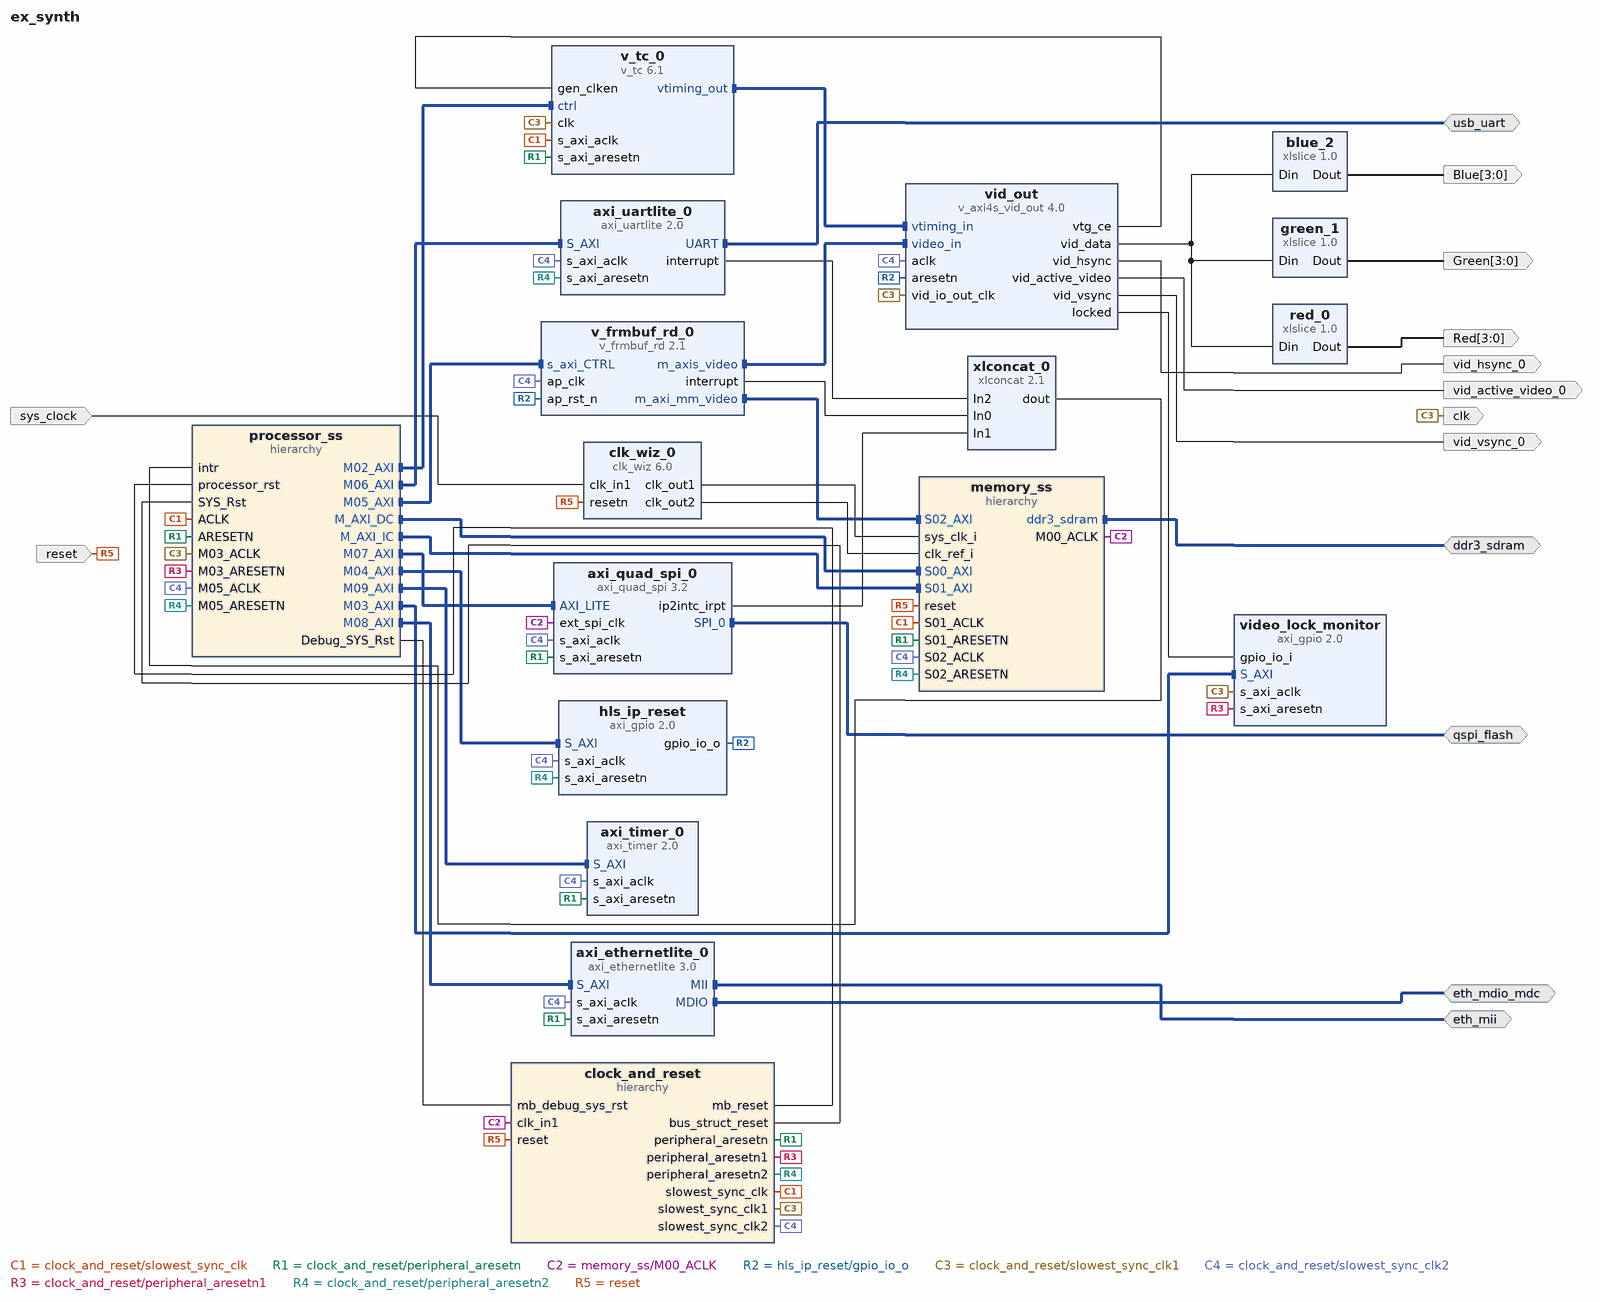
[diagram p0: block diagram of the top level]
# Vivado block design ex_synth, xc7a35ticsg324-1L, Vivado 2019.1
create_bd_design ex_synth

create_bd_intf_port -mode Master -vlnv xilinx.com:interface:ddrx_rtl:1.0 ddr3_sdram
create_bd_intf_port -mode Master -vlnv xilinx.com:interface:uart_rtl:1.0 usb_uart
create_bd_intf_port -mode Master -vlnv xilinx.com:interface:spi_rtl:1.0 qspi_flash
create_bd_intf_port -mode Master -vlnv xilinx.com:interface:mii_rtl:1.0 eth_mii
create_bd_intf_port -mode Master -vlnv xilinx.com:interface:mdio_rtl:1.0 eth_mdio_mdc
create_bd_port -dir I -type rst reset
set_property -dict {CONFIG.POLARITY ACTIVE_LOW} [get_bd_ports reset]
create_bd_port -dir I -type clk sys_clock
set_property -dict {CONFIG.FREQ_HZ 100000000 CONFIG.PHASE 0.000} [get_bd_ports sys_clock]
create_bd_port -dir O vid_hsync_0
create_bd_port -dir O vid_vsync_0
create_bd_port -dir O vid_active_video_0
create_bd_port -dir O -from 3 -to 0 Red
create_bd_port -dir O -from 3 -to 0 Blue
create_bd_port -dir O -from 3 -to 0 Green
create_bd_port -dir O -type clk clk

create_bd_cell -type hier memory_ss
create_bd_cell -type hier clock_and_reset
create_bd_cell -type hier processor_ss
create_bd_cell -type ip -vlnv xilinx.com:ip:axi_gpio:2.0 hls_ip_reset
set_property -dict {CONFIG.C_ALL_OUTPUTS 1 CONFIG.C_GPIO_WIDTH 1} [get_bd_cells hls_ip_reset]
create_bd_cell -type ip -vlnv xilinx.com:ip:v_frmbuf_rd:2.1 v_frmbuf_rd_0
set_property -dict [list \
  CONFIG.AXIMM_ADDR_WIDTH 32 \
  CONFIG.AXIMM_BURST_LENGTH 16 \
  CONFIG.AXIMM_DATA_WIDTH 64 \
  CONFIG.AXIMM_NUM_OUTSTANDING 4 \
  CONFIG.C_M_AXI_MM_VIDEO_DATA_WIDTH 64 \
  CONFIG.HAS_ALPHA 0 \
  CONFIG.HAS_BGR8 1 \
  CONFIG.HAS_BGRX8 1 \
  CONFIG.HAS_INTERLACED 0 \
  CONFIG.HAS_RGB8 1 \
  CONFIG.HAS_RGBX8 1 \
  CONFIG.HAS_UYVY8 1 \
  CONFIG.HAS_Y8 1 \
  CONFIG.HAS_YUV8 1 \
  CONFIG.HAS_YUVX8 1 \
  CONFIG.HAS_YUYV8 1 \
  CONFIG.HAS_Y_UV8 1 \
  CONFIG.HAS_Y_UV8_420 1 \
  CONFIG.MAX_COLS 1057 \
  CONFIG.MAX_DATA_WIDTH 8 \
  CONFIG.MAX_NR_PLANES 2 \
  CONFIG.MAX_ROWS 629 \
  CONFIG.SAMPLES_PER_CLOCK 1 \
] [get_bd_cells v_frmbuf_rd_0]
create_bd_cell -type ip -vlnv xilinx.com:ip:v_tc:6.1 v_tc_0
set_property -dict [list \
  CONFIG.VIDEO_MODE 800x600p \
  CONFIG.enable_detection false \
  CONFIG.max_clocks_per_line 4096 \
] [get_bd_cells v_tc_0]
create_bd_cell -type ip -vlnv xilinx.com:ip:v_axi4s_vid_out:4.0 vid_out
set_property -dict [list \
  CONFIG.C_ADDR_WIDTH 13 \
  CONFIG.C_HAS_ASYNC_CLK 1 \
  CONFIG.C_NATIVE_COMPONENT_WIDTH 8 \
  CONFIG.C_PIXELS_PER_CLOCK 1 \
] [get_bd_cells vid_out]
create_bd_cell -type ip -vlnv xilinx.com:ip:axi_gpio:2.0 video_lock_monitor
set_property -dict {CONFIG.C_ALL_INPUTS 1 CONFIG.C_GPIO_WIDTH 1} [get_bd_cells video_lock_monitor]
create_bd_cell -type ip -vlnv xilinx.com:ip:clk_wiz:6.0 clk_wiz_0
set_property -dict [list \
  CONFIG.CLKOUT1_JITTER 118.758 \
  CONFIG.CLKOUT1_REQUESTED_OUT_FREQ 166.667 \
  CONFIG.CLKOUT2_JITTER 114.829 \
  CONFIG.CLKOUT2_PHASE_ERROR 98.575 \
  CONFIG.CLKOUT2_REQUESTED_OUT_FREQ 200 \
  CONFIG.CLKOUT2_USED true \
  CONFIG.CLK_IN1_BOARD_INTERFACE sys_clock \
  CONFIG.MMCM_CLKOUT0_DIVIDE_F 6.000 \
  CONFIG.MMCM_CLKOUT1_DIVIDE 5 \
  CONFIG.NUM_OUT_CLKS 2 \
  CONFIG.RESET_PORT resetn \
  CONFIG.RESET_TYPE ACTIVE_LOW \
  CONFIG.USE_BOARD_FLOW true \
] [get_bd_cells clk_wiz_0]
create_bd_cell -type ip -vlnv xilinx.com:ip:xlslice:1.0 red_0
set_property -dict {CONFIG.DIN_FROM 23 CONFIG.DIN_TO 20 CONFIG.DIN_WIDTH 24 CONFIG.DOUT_WIDTH 4} [get_bd_cells red_0]
create_bd_cell -type ip -vlnv xilinx.com:ip:xlslice:1.0 green_1
set_property -dict {CONFIG.DIN_FROM 7 CONFIG.DIN_TO 4 CONFIG.DIN_WIDTH 24 CONFIG.DOUT_WIDTH 4} [get_bd_cells green_1]
create_bd_cell -type ip -vlnv xilinx.com:ip:xlslice:1.0 blue_2
set_property -dict {CONFIG.DIN_FROM 15 CONFIG.DIN_TO 12 CONFIG.DIN_WIDTH 24 CONFIG.DOUT_WIDTH 4} [get_bd_cells blue_2]
create_bd_cell -type ip -vlnv xilinx.com:ip:axi_uartlite:2.0 axi_uartlite_0
set_property -dict {CONFIG.UARTLITE_BOARD_INTERFACE usb_uart CONFIG.USE_BOARD_FLOW true} [get_bd_cells axi_uartlite_0]
create_bd_cell -type ip -vlnv xilinx.com:ip:axi_quad_spi:3.2 axi_quad_spi_0
set_property -dict {CONFIG.QSPI_BOARD_INTERFACE qspi_flash CONFIG.USE_BOARD_FLOW true} [get_bd_cells axi_quad_spi_0]
create_bd_cell -type ip -vlnv xilinx.com:ip:xlconcat:2.1 xlconcat_0
set_property -dict {CONFIG.NUM_PORTS 3} [get_bd_cells xlconcat_0]
create_bd_cell -type ip -vlnv xilinx.com:ip:axi_ethernetlite:3.0 axi_ethernetlite_0
set_property -dict [list \
  CONFIG.MDIO_BOARD_INTERFACE eth_mdio_mdc \
  CONFIG.MII_BOARD_INTERFACE eth_mii \
  CONFIG.USE_BOARD_FLOW true \
] [get_bd_cells axi_ethernetlite_0]
create_bd_cell -type ip -vlnv xilinx.com:ip:axi_timer:2.0 axi_timer_0

# ---- hierarchy /memory_ss ----
current_bd_instance /memory_ss
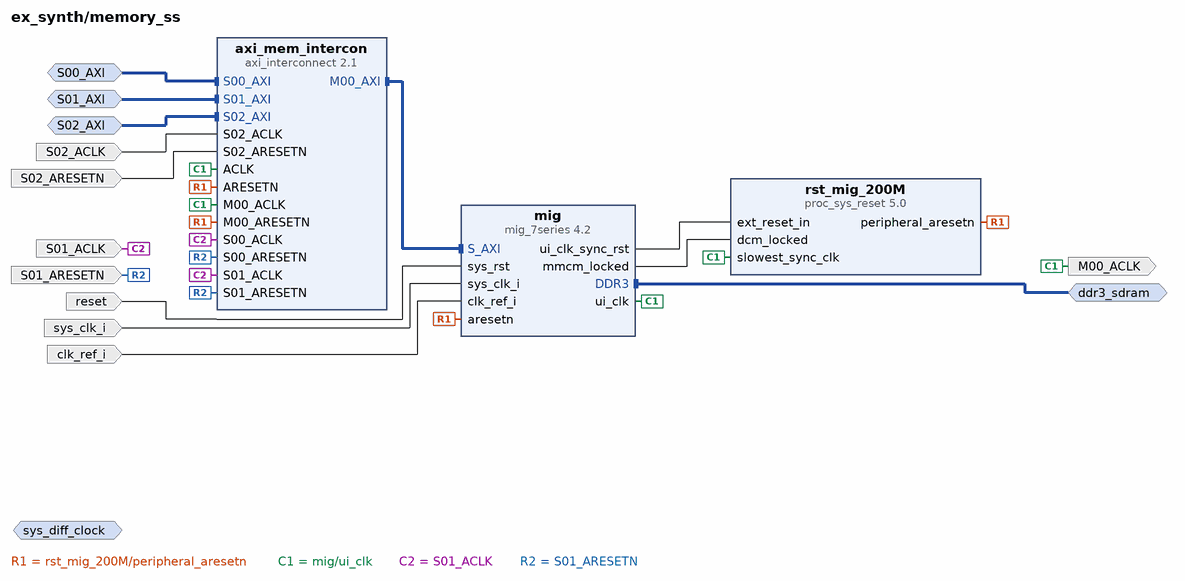
[diagram p1: block diagram inside /memory_ss]
create_bd_intf_pin -mode Master -vlnv xilinx.com:interface:ddrx_rtl:1.0 ddr3_sdram
create_bd_intf_pin -mode Slave -vlnv xilinx.com:interface:diff_clock_rtl:1.0 sys_diff_clock
create_bd_intf_pin -mode Slave -vlnv xilinx.com:interface:aximm_rtl:1.0 S00_AXI
create_bd_intf_pin -mode Slave -vlnv xilinx.com:interface:aximm_rtl:1.0 S01_AXI
create_bd_intf_pin -mode Slave -vlnv xilinx.com:interface:aximm_rtl:1.0 S02_AXI
create_bd_pin -dir I -type rst reset
create_bd_pin -dir O -type clk M00_ACLK
create_bd_pin -dir I -type clk S01_ACLK
create_bd_pin -dir I -type rst S01_ARESETN
create_bd_pin -dir I -type clk S02_ACLK
create_bd_pin -dir I -type rst S02_ARESETN
create_bd_pin -dir I -type clk sys_clk_i
create_bd_pin -dir I -type clk clk_ref_i

create_bd_cell -type ip -vlnv xilinx.com:ip:axi_interconnect:2.1 axi_mem_intercon
set_property -dict {CONFIG.NUM_MI 1 CONFIG.NUM_SI 3} [get_bd_cells axi_mem_intercon]
create_bd_cell -type ip -vlnv xilinx.com:ip:mig_7series:4.2 mig
set_property -dict [list \
  CONFIG.BOARD_MIG_PARAM ddr3_sdram \
  CONFIG.RESET_BOARD_INTERFACE reset \
  CONFIG.XML_INPUT_FILE board.prj \
] [get_bd_cells mig]
create_bd_cell -type ip -vlnv xilinx.com:ip:proc_sys_reset:5.0 rst_mig_200M

# ---- hierarchy /clock_and_reset ----
current_bd_instance /clock_and_reset
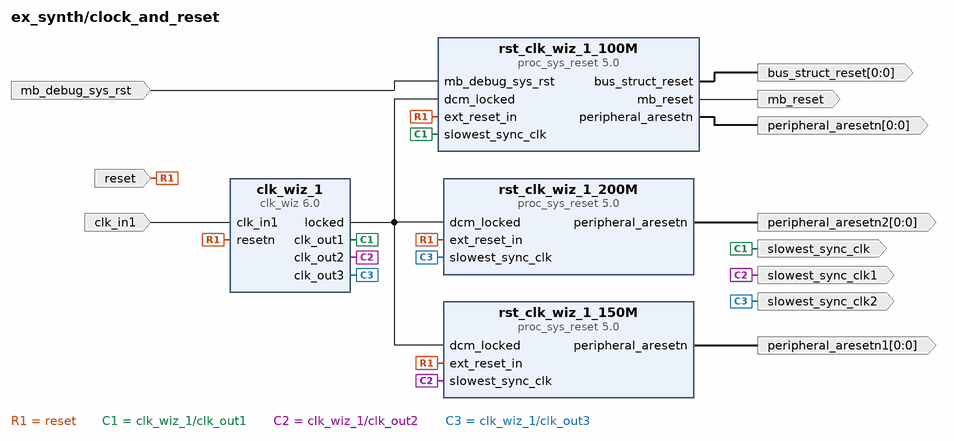
[diagram p2: block diagram inside /clock_and_reset]
create_bd_pin -dir I -type rst reset
create_bd_pin -dir I -type clk clk_in1
create_bd_pin -dir O -type clk slowest_sync_clk
create_bd_pin -dir O -type clk slowest_sync_clk1
create_bd_pin -dir O -type clk slowest_sync_clk2
create_bd_pin -dir I -type rst mb_debug_sys_rst
create_bd_pin -dir O -type rst mb_reset
create_bd_pin -dir O -from 0 -to 0 -type rst bus_struct_reset
create_bd_pin -dir O -from 0 -to 0 -type rst peripheral_aresetn
create_bd_pin -dir O -from 0 -to 0 -type rst peripheral_aresetn1
create_bd_pin -dir O -from 0 -to 0 -type rst peripheral_aresetn2

create_bd_cell -type ip -vlnv xilinx.com:ip:clk_wiz:6.0 clk_wiz_1
set_property -dict [list \
  CONFIG.CLKIN1_JITTER_PS 120.0 \
  CONFIG.CLKOUT1_JITTER 141.289 \
  CONFIG.CLKOUT1_PHASE_ERROR 100.585 \
  CONFIG.CLKOUT1_REQUESTED_OUT_FREQ 83.3333 \
  CONFIG.CLKOUT2_JITTER 166.329 \
  CONFIG.CLKOUT2_PHASE_ERROR 100.585 \
  CONFIG.CLKOUT2_REQUESTED_OUT_FREQ 40 \
  CONFIG.CLKOUT2_USED true \
  CONFIG.CLKOUT3_JITTER 141.289 \
  CONFIG.CLKOUT3_PHASE_ERROR 100.585 \
  CONFIG.CLKOUT3_REQUESTED_OUT_FREQ 83.3333 \
  CONFIG.CLKOUT3_USED true \
  CONFIG.MMCM_CLKFBOUT_MULT_F 12.000 \
  CONFIG.MMCM_CLKIN1_PERIOD 12.000 \
  CONFIG.MMCM_CLKIN2_PERIOD 10.0 \
  CONFIG.MMCM_CLKOUT0_DIVIDE_F 12.000 \
  CONFIG.MMCM_CLKOUT1_DIVIDE 25 \
  CONFIG.MMCM_CLKOUT2_DIVIDE 12 \
  CONFIG.MMCM_DIVCLK_DIVIDE 1 \
  CONFIG.NUM_OUT_CLKS 3 \
  CONFIG.PRIM_SOURCE No_buffer \
  CONFIG.RESET_BOARD_INTERFACE reset \
  CONFIG.RESET_PORT resetn \
  CONFIG.RESET_TYPE ACTIVE_LOW \
  CONFIG.USE_BOARD_FLOW true \
] [get_bd_cells clk_wiz_1]
create_bd_cell -type ip -vlnv xilinx.com:ip:proc_sys_reset:5.0 rst_clk_wiz_1_100M
set_property -dict {CONFIG.RESET_BOARD_INTERFACE reset CONFIG.USE_BOARD_FLOW true} [get_bd_cells rst_clk_wiz_1_100M]
create_bd_cell -type ip -vlnv xilinx.com:ip:proc_sys_reset:5.0 rst_clk_wiz_1_150M
set_property -dict {CONFIG.RESET_BOARD_INTERFACE reset CONFIG.USE_BOARD_FLOW true} [get_bd_cells rst_clk_wiz_1_150M]
create_bd_cell -type ip -vlnv xilinx.com:ip:proc_sys_reset:5.0 rst_clk_wiz_1_200M
set_property -dict {CONFIG.RESET_BOARD_INTERFACE reset CONFIG.USE_BOARD_FLOW true} [get_bd_cells rst_clk_wiz_1_200M]

# ---- hierarchy /processor_ss ----
current_bd_instance /processor_ss
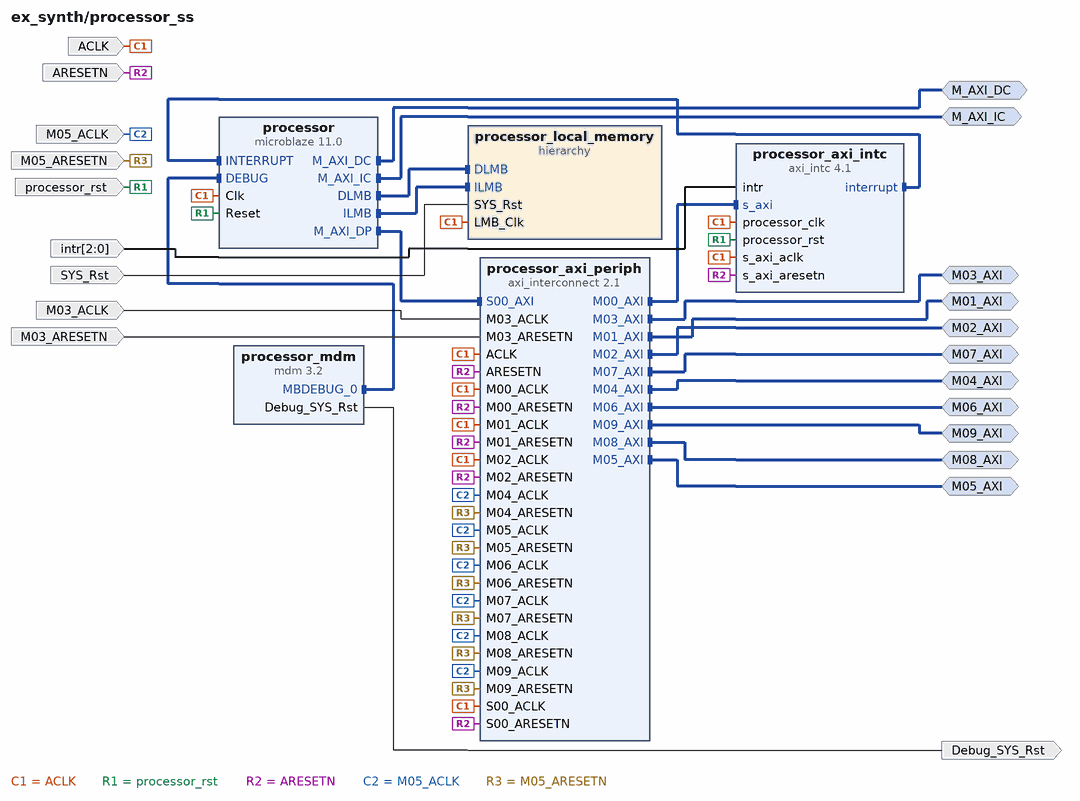
[diagram p3: block diagram inside /processor_ss]
create_bd_intf_pin -mode Master -vlnv xilinx.com:interface:aximm_rtl:1.0 M_AXI_DC
create_bd_intf_pin -mode Master -vlnv xilinx.com:interface:aximm_rtl:1.0 M_AXI_IC
create_bd_intf_pin -mode Master -vlnv xilinx.com:interface:aximm_rtl:1.0 M01_AXI
create_bd_intf_pin -mode Master -vlnv xilinx.com:interface:aximm_rtl:1.0 M02_AXI
create_bd_intf_pin -mode Master -vlnv xilinx.com:interface:aximm_rtl:1.0 M03_AXI
create_bd_intf_pin -mode Master -vlnv xilinx.com:interface:aximm_rtl:1.0 M04_AXI
create_bd_intf_pin -mode Master -vlnv xilinx.com:interface:aximm_rtl:1.0 M05_AXI
create_bd_intf_pin -mode Master -vlnv xilinx.com:interface:aximm_rtl:1.0 M06_AXI
create_bd_intf_pin -mode Master -vlnv xilinx.com:interface:aximm_rtl:1.0 M07_AXI
create_bd_intf_pin -mode Master -vlnv xilinx.com:interface:aximm_rtl:1.0 M08_AXI
create_bd_intf_pin -mode Master -vlnv xilinx.com:interface:aximm_rtl:1.0 M09_AXI
create_bd_pin -dir I -type clk ACLK
create_bd_pin -dir I -type rst processor_rst
create_bd_pin -dir I -type rst ARESETN
create_bd_pin -dir I -from 2 -to 0 -type intr intr
create_bd_pin -dir I -type clk M03_ACLK
create_bd_pin -dir I -type rst M03_ARESETN
create_bd_pin -dir I -type clk M05_ACLK
create_bd_pin -dir I -type rst M05_ARESETN
create_bd_pin -dir I -type rst SYS_Rst
create_bd_pin -dir O -type rst Debug_SYS_Rst

create_bd_cell -type hier processor_local_memory
create_bd_cell -type ip -vlnv xilinx.com:ip:mdm:3.2 processor_mdm
create_bd_cell -type ip -vlnv xilinx.com:ip:microblaze:11.0 processor
set_property -dict [list \
  CONFIG.C_ADDR_TAG_BITS 16 \
  CONFIG.C_CACHE_BYTE_SIZE 16384 \
  CONFIG.C_DCACHE_ADDR_TAG 16 \
  CONFIG.C_DCACHE_BYTE_SIZE 16384 \
  CONFIG.C_DEBUG_ENABLED 1 \
  CONFIG.C_DIV_ZERO_EXCEPTION 1 \
  CONFIG.C_D_AXI 1 \
  CONFIG.C_D_LMB 1 \
  CONFIG.C_ICACHE_LINE_LEN 8 \
  CONFIG.C_ICACHE_STREAMS 1 \
  CONFIG.C_ICACHE_VICTIMS 8 \
  CONFIG.C_ILL_OPCODE_EXCEPTION 1 \
  CONFIG.C_I_LMB 1 \
  CONFIG.C_MMU_ZONES 2 \
  CONFIG.C_M_AXI_D_BUS_EXCEPTION 1 \
  CONFIG.C_M_AXI_I_BUS_EXCEPTION 1 \
  CONFIG.C_OPCODE_0x0_ILLEGAL 1 \
  CONFIG.C_PVR 2 \
  CONFIG.C_UNALIGNED_EXCEPTIONS 1 \
  CONFIG.C_USE_BARREL 1 \
  CONFIG.C_USE_DCACHE 1 \
  CONFIG.C_USE_DIV 1 \
  CONFIG.C_USE_HW_MUL 2 \
  CONFIG.C_USE_ICACHE 1 \
  CONFIG.C_USE_MMU 3 \
  CONFIG.C_USE_MSR_INSTR 1 \
  CONFIG.C_USE_PCMP_INSTR 1 \
  CONFIG.G_TEMPLATE_LIST 4 \
  CONFIG.G_USE_EXCEPTIONS 1 \
] [get_bd_cells processor]
create_bd_cell -type ip -vlnv xilinx.com:ip:axi_intc:4.1 processor_axi_intc
set_property -dict {CONFIG.C_HAS_FAST 1} [get_bd_cells processor_axi_intc]
create_bd_cell -type ip -vlnv xilinx.com:ip:axi_interconnect:2.1 processor_axi_periph
set_property -dict {CONFIG.NUM_MI 10} [get_bd_cells processor_axi_periph]

# ---- hierarchy /processor_ss/processor_local_memory ----
current_bd_instance /processor_ss/processor_local_memory
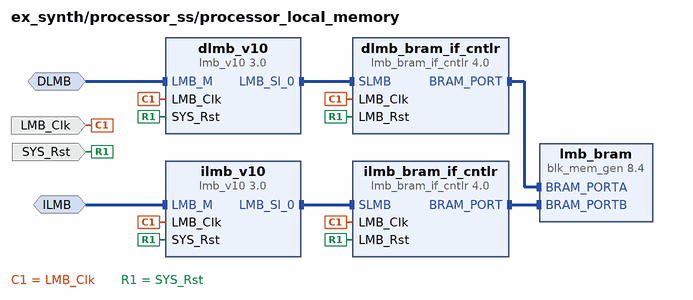
[diagram p4: block diagram inside /processor_ss/processor_local_memory]
create_bd_intf_pin -mode MirroredMaster -vlnv xilinx.com:interface:lmb_rtl:1.0 DLMB
create_bd_intf_pin -mode MirroredMaster -vlnv xilinx.com:interface:lmb_rtl:1.0 ILMB
create_bd_pin -dir I -type clk LMB_Clk
create_bd_pin -dir I -type rst SYS_Rst

create_bd_cell -type ip -vlnv xilinx.com:ip:lmb_bram_if_cntlr:4.0 dlmb_bram_if_cntlr
set_property -dict {CONFIG.C_ECC 0} [get_bd_cells dlmb_bram_if_cntlr]
create_bd_cell -type ip -vlnv xilinx.com:ip:lmb_v10:3.0 dlmb_v10
create_bd_cell -type ip -vlnv xilinx.com:ip:lmb_bram_if_cntlr:4.0 ilmb_bram_if_cntlr
set_property -dict {CONFIG.C_ECC 0} [get_bd_cells ilmb_bram_if_cntlr]
create_bd_cell -type ip -vlnv xilinx.com:ip:lmb_v10:3.0 ilmb_v10
create_bd_cell -type ip -vlnv xilinx.com:ip:blk_mem_gen:8.4 lmb_bram
set_property -dict [list \
  CONFIG.Enable_B Use_ENB_Pin \
  CONFIG.Memory_Type True_Dual_Port_RAM \
  CONFIG.Port_B_Clock 100 \
  CONFIG.Port_B_Enable_Rate 100 \
  CONFIG.Port_B_Write_Rate 50 \
  CONFIG.Use_RSTB_Pin true \
  CONFIG.use_bram_block BRAM_Controller \
] [get_bd_cells lmb_bram]

# ---- connections ----

current_bd_instance /memory_ss
connect_bd_intf_net [get_bd_intf_pins ddr3_sdram] [get_bd_intf_pins mig/DDR3]
connect_bd_intf_net [get_bd_intf_pins axi_mem_intercon/M00_AXI] [get_bd_intf_pins mig/S_AXI]
connect_bd_intf_net -intf_net processor_M_AXI_DC [get_bd_intf_pins S00_AXI] [get_bd_intf_pins axi_mem_intercon/S00_AXI]
connect_bd_intf_net -intf_net processor_M_AXI_IC [get_bd_intf_pins S01_AXI] [get_bd_intf_pins axi_mem_intercon/S01_AXI]
connect_bd_intf_net -intf_net v_frmbuf_rd_0_m_axi_mm_video [get_bd_intf_pins S02_AXI] [get_bd_intf_pins axi_mem_intercon/S02_AXI]
connect_bd_net [get_bd_pins mig/ui_clk_sync_rst] [get_bd_pins rst_mig_200M/ext_reset_in]
connect_bd_net [get_bd_pins mig/mmcm_locked] [get_bd_pins rst_mig_200M/dcm_locked]
connect_bd_net [get_bd_pins rst_mig_200M/peripheral_aresetn] \
  [get_bd_pins axi_mem_intercon/ARESETN] [get_bd_pins axi_mem_intercon/M00_ARESETN] [get_bd_pins mig/aresetn]
connect_bd_net [get_bd_pins reset] [get_bd_pins mig/sys_rst]
connect_bd_net [get_bd_pins mig/ui_clk] \
  [get_bd_pins M00_ACLK] [get_bd_pins axi_mem_intercon/ACLK] [get_bd_pins axi_mem_intercon/M00_ACLK] \
  [get_bd_pins rst_mig_200M/slowest_sync_clk]
connect_bd_net -net processor_Clk [get_bd_pins S01_ACLK] [get_bd_pins axi_mem_intercon/S00_ACLK] [get_bd_pins axi_mem_intercon/S01_ACLK]
connect_bd_net -net rst_clk_wiz_1_100M_peripheral_aresetn [get_bd_pins S01_ARESETN] \
  [get_bd_pins axi_mem_intercon/S00_ARESETN] [get_bd_pins axi_mem_intercon/S01_ARESETN]
connect_bd_net -net clk_wiz_1_clk_out3 [get_bd_pins S02_ACLK] [get_bd_pins axi_mem_intercon/S02_ACLK]
connect_bd_net -net rst_clk_wiz_1_200M_peripheral_aresetn [get_bd_pins S02_ARESETN] [get_bd_pins axi_mem_intercon/S02_ARESETN]
connect_bd_net [get_bd_pins sys_clk_i] [get_bd_pins mig/sys_clk_i]
connect_bd_net [get_bd_pins clk_ref_i] [get_bd_pins mig/clk_ref_i]

current_bd_instance /clock_and_reset
connect_bd_net [get_bd_pins clk_wiz_1/locked] \
  [get_bd_pins rst_clk_wiz_1_100M/dcm_locked] [get_bd_pins rst_clk_wiz_1_150M/dcm_locked] \
  [get_bd_pins rst_clk_wiz_1_200M/dcm_locked]
connect_bd_net [get_bd_pins reset] \
  [get_bd_pins rst_clk_wiz_1_100M/ext_reset_in] [get_bd_pins rst_clk_wiz_1_150M/ext_reset_in] \
  [get_bd_pins rst_clk_wiz_1_200M/ext_reset_in] [get_bd_pins clk_wiz_1/resetn]
connect_bd_net -net mig_ui_clk [get_bd_pins clk_in1] [get_bd_pins clk_wiz_1/clk_in1]
connect_bd_net -net processor_Clk [get_bd_pins clk_wiz_1/clk_out1] [get_bd_pins slowest_sync_clk] [get_bd_pins rst_clk_wiz_1_100M/slowest_sync_clk]
connect_bd_net [get_bd_pins clk_wiz_1/clk_out2] [get_bd_pins slowest_sync_clk1] [get_bd_pins rst_clk_wiz_1_150M/slowest_sync_clk]
connect_bd_net [get_bd_pins clk_wiz_1/clk_out3] [get_bd_pins slowest_sync_clk2] [get_bd_pins rst_clk_wiz_1_200M/slowest_sync_clk]
connect_bd_net -net mdm_1_debug_sys_rst [get_bd_pins mb_debug_sys_rst] [get_bd_pins rst_clk_wiz_1_100M/mb_debug_sys_rst]
connect_bd_net [get_bd_pins rst_clk_wiz_1_100M/mb_reset] [get_bd_pins mb_reset]
connect_bd_net [get_bd_pins rst_clk_wiz_1_100M/bus_struct_reset] [get_bd_pins bus_struct_reset]
connect_bd_net [get_bd_pins rst_clk_wiz_1_100M/peripheral_aresetn] [get_bd_pins peripheral_aresetn]
connect_bd_net [get_bd_pins rst_clk_wiz_1_150M/peripheral_aresetn] [get_bd_pins peripheral_aresetn1]
connect_bd_net [get_bd_pins rst_clk_wiz_1_200M/peripheral_aresetn] [get_bd_pins peripheral_aresetn2]

current_bd_instance /processor_ss
connect_bd_intf_net [get_bd_intf_pins processor/DLMB] [get_bd_intf_pins processor_local_memory/DLMB]
connect_bd_intf_net [get_bd_intf_pins processor/ILMB] [get_bd_intf_pins processor_local_memory/ILMB]
connect_bd_intf_net [get_bd_intf_pins M09_AXI] [get_bd_intf_pins processor_axi_periph/M09_AXI]
connect_bd_intf_net [get_bd_intf_pins M07_AXI] [get_bd_intf_pins processor_axi_periph/M07_AXI]
connect_bd_intf_net [get_bd_intf_pins M08_AXI] [get_bd_intf_pins processor_axi_periph/M08_AXI]
connect_bd_intf_net [get_bd_intf_pins processor_mdm/MBDEBUG_0] [get_bd_intf_pins processor/DEBUG]
connect_bd_intf_net -intf_net processor_intc_axi [get_bd_intf_pins processor_axi_periph/M00_AXI] [get_bd_intf_pins processor_axi_intc/s_axi]
connect_bd_intf_net [get_bd_intf_pins processor_axi_intc/interrupt] [get_bd_intf_pins processor/INTERRUPT]
connect_bd_intf_net -intf_net processor_axi_dp [get_bd_intf_pins processor_axi_periph/S00_AXI] [get_bd_intf_pins processor/M_AXI_DP]
connect_bd_intf_net [get_bd_intf_pins M06_AXI] [get_bd_intf_pins processor_axi_periph/M06_AXI]
connect_bd_intf_net [get_bd_intf_pins M03_AXI] [get_bd_intf_pins processor_axi_periph/M03_AXI]
connect_bd_intf_net [get_bd_intf_pins M04_AXI] [get_bd_intf_pins processor_axi_periph/M04_AXI]
connect_bd_intf_net [get_bd_intf_pins M02_AXI] [get_bd_intf_pins processor_axi_periph/M02_AXI]
connect_bd_intf_net [get_bd_intf_pins M01_AXI] [get_bd_intf_pins processor_axi_periph/M01_AXI]
connect_bd_intf_net [get_bd_intf_pins M_AXI_DC] [get_bd_intf_pins processor/M_AXI_DC]
connect_bd_intf_net [get_bd_intf_pins M_AXI_IC] [get_bd_intf_pins processor/M_AXI_IC]
connect_bd_intf_net [get_bd_intf_pins M05_AXI] [get_bd_intf_pins processor_axi_periph/M05_AXI]
connect_bd_net -net processor_Clk [get_bd_pins ACLK] \
  [get_bd_pins processor_local_memory/LMB_Clk] [get_bd_pins processor/Clk] [get_bd_pins processor_axi_intc/s_axi_aclk] \
  [get_bd_pins processor_axi_intc/processor_clk] [get_bd_pins processor_axi_periph/ACLK] \
  [get_bd_pins processor_axi_periph/S00_ACLK] [get_bd_pins processor_axi_periph/M00_ACLK] \
  [get_bd_pins processor_axi_periph/M01_ACLK] [get_bd_pins processor_axi_periph/M02_ACLK]
connect_bd_net -net rst_clk_wiz_1_100M_mb_reset [get_bd_pins processor_rst] \
  [get_bd_pins processor/Reset] [get_bd_pins processor_axi_intc/processor_rst]
connect_bd_net -net rst_clk_wiz_1_100M_peripheral_aresetn [get_bd_pins ARESETN] \
  [get_bd_pins processor_axi_intc/s_axi_aresetn] [get_bd_pins processor_axi_periph/ARESETN] \
  [get_bd_pins processor_axi_periph/S00_ARESETN] [get_bd_pins processor_axi_periph/M00_ARESETN] \
  [get_bd_pins processor_axi_periph/M01_ARESETN] [get_bd_pins processor_axi_periph/M02_ARESETN]
connect_bd_net -net v_frmbuf_rd_0_interrupt [get_bd_pins intr] [get_bd_pins processor_axi_intc/intr]
connect_bd_net -net clk_wiz_1_clk_out2 [get_bd_pins M03_ACLK] [get_bd_pins processor_axi_periph/M03_ACLK]
connect_bd_net -net rst_clk_wiz_1_150M_peripheral_aresetn [get_bd_pins M03_ARESETN] [get_bd_pins processor_axi_periph/M03_ARESETN]
connect_bd_net -net clk_wiz_1_clk_out3 [get_bd_pins M05_ACLK] \
  [get_bd_pins processor_axi_periph/M04_ACLK] [get_bd_pins processor_axi_periph/M05_ACLK] \
  [get_bd_pins processor_axi_periph/M06_ACLK] [get_bd_pins processor_axi_periph/M07_ACLK] \
  [get_bd_pins processor_axi_periph/M08_ACLK] [get_bd_pins processor_axi_periph/M09_ACLK]
connect_bd_net -net rst_clk_wiz_1_200M_peripheral_aresetn [get_bd_pins M05_ARESETN] \
  [get_bd_pins processor_axi_periph/M04_ARESETN] [get_bd_pins processor_axi_periph/M05_ARESETN] \
  [get_bd_pins processor_axi_periph/M06_ARESETN] [get_bd_pins processor_axi_periph/M07_ARESETN] \
  [get_bd_pins processor_axi_periph/M08_ARESETN] [get_bd_pins processor_axi_periph/M09_ARESETN]
connect_bd_net -net rst_clk_wiz_1_100M_bus_struct_reset [get_bd_pins SYS_Rst] [get_bd_pins processor_local_memory/SYS_Rst]
connect_bd_net -net mdm_1_debug_sys_rst [get_bd_pins processor_mdm/Debug_SYS_Rst] [get_bd_pins Debug_SYS_Rst]
set_property HDL_ATTRIBUTE.BMM_INFO_PROCESSOR {microblaze-le > ex_synth processor_ss/processor_local_memory/dlmb_bram_if_cntlr} [get_bd_cells processor]
set_property HDL_ATTRIBUTE.KEEP_HIERARCHY yes [get_bd_cells processor]

current_bd_instance /processor_ss/processor_local_memory
connect_bd_intf_net -intf_net processor_dlmb_bus [get_bd_intf_pins dlmb_v10/LMB_Sl_0] [get_bd_intf_pins dlmb_bram_if_cntlr/SLMB]
connect_bd_intf_net -intf_net processor_dlmb [get_bd_intf_pins DLMB] [get_bd_intf_pins dlmb_v10/LMB_M]
connect_bd_intf_net -intf_net processor_ilmb_cntlr [get_bd_intf_pins ilmb_bram_if_cntlr/BRAM_PORT] [get_bd_intf_pins lmb_bram/BRAM_PORTB]
connect_bd_intf_net -intf_net processor_dlmb_cntlr [get_bd_intf_pins dlmb_bram_if_cntlr/BRAM_PORT] [get_bd_intf_pins lmb_bram/BRAM_PORTA]
connect_bd_intf_net -intf_net processor_ilmb_bus [get_bd_intf_pins ilmb_v10/LMB_Sl_0] [get_bd_intf_pins ilmb_bram_if_cntlr/SLMB]
connect_bd_intf_net -intf_net processor_ilmb [get_bd_intf_pins ILMB] [get_bd_intf_pins ilmb_v10/LMB_M]
connect_bd_net -net processor_Clk [get_bd_pins LMB_Clk] \
  [get_bd_pins dlmb_bram_if_cntlr/LMB_Clk] [get_bd_pins dlmb_v10/LMB_Clk] [get_bd_pins ilmb_bram_if_cntlr/LMB_Clk] \
  [get_bd_pins ilmb_v10/LMB_Clk]
connect_bd_net [get_bd_pins SYS_Rst] \
  [get_bd_pins dlmb_bram_if_cntlr/LMB_Rst] [get_bd_pins dlmb_v10/SYS_Rst] [get_bd_pins ilmb_bram_if_cntlr/LMB_Rst] \
  [get_bd_pins ilmb_v10/SYS_Rst]
set_property HDL_ATTRIBUTE.BMM_INFO_ADDRESS_SPACE {byte  0x00000000 32 > ex_synth processor_ss/processor_local_memory/lmb_bram} [get_bd_cells dlmb_bram_if_cntlr]
set_property HDL_ATTRIBUTE.KEEP_HIERARCHY yes [get_bd_cells dlmb_bram_if_cntlr]

current_bd_instance /
connect_bd_intf_net [get_bd_intf_pins axi_quad_spi_0/AXI_LITE] [get_bd_intf_pins processor_ss/M07_AXI]
connect_bd_intf_net [get_bd_intf_ports usb_uart] [get_bd_intf_pins axi_uartlite_0/UART]
connect_bd_intf_net -intf_net mig_DDR3 [get_bd_intf_ports ddr3_sdram] [get_bd_intf_pins memory_ss/ddr3_sdram]
connect_bd_intf_net [get_bd_intf_pins axi_uartlite_0/S_AXI] [get_bd_intf_pins processor_ss/M06_AXI]
connect_bd_intf_net -intf_net processor_M_AXI_DC [get_bd_intf_pins processor_ss/M_AXI_DC] [get_bd_intf_pins memory_ss/S00_AXI]
connect_bd_intf_net -intf_net processor_M_AXI_IC [get_bd_intf_pins processor_ss/M_AXI_IC] [get_bd_intf_pins memory_ss/S01_AXI]
connect_bd_intf_net [get_bd_intf_pins v_frmbuf_rd_0/m_axis_video] [get_bd_intf_pins vid_out/video_in]
connect_bd_intf_net [get_bd_intf_pins processor_ss/M02_AXI] [get_bd_intf_pins v_tc_0/ctrl]
connect_bd_intf_net [get_bd_intf_pins processor_ss/M04_AXI] [get_bd_intf_pins hls_ip_reset/S_AXI]
connect_bd_intf_net [get_bd_intf_pins v_tc_0/vtiming_out] [get_bd_intf_pins vid_out/vtiming_in]
connect_bd_intf_net [get_bd_intf_pins processor_ss/M03_AXI] [get_bd_intf_pins video_lock_monitor/S_AXI]
connect_bd_intf_net [get_bd_intf_pins v_frmbuf_rd_0/m_axi_mm_video] [get_bd_intf_pins memory_ss/S02_AXI]
connect_bd_intf_net [get_bd_intf_pins processor_ss/M05_AXI] [get_bd_intf_pins v_frmbuf_rd_0/s_axi_CTRL]
connect_bd_intf_net [get_bd_intf_pins axi_ethernetlite_0/S_AXI] [get_bd_intf_pins processor_ss/M08_AXI]
connect_bd_intf_net [get_bd_intf_ports qspi_flash] [get_bd_intf_pins axi_quad_spi_0/SPI_0]
connect_bd_intf_net [get_bd_intf_ports eth_mii] [get_bd_intf_pins axi_ethernetlite_0/MII]
connect_bd_intf_net [get_bd_intf_pins axi_timer_0/S_AXI] [get_bd_intf_pins processor_ss/M09_AXI]
connect_bd_intf_net [get_bd_intf_ports eth_mdio_mdc] [get_bd_intf_pins axi_ethernetlite_0/MDIO]
connect_bd_net -net processor_Clk [get_bd_pins clock_and_reset/slowest_sync_clk] \
  [get_bd_pins memory_ss/S01_ACLK] [get_bd_pins processor_ss/ACLK] [get_bd_pins v_tc_0/s_axi_aclk]
connect_bd_net -net rst_clk_wiz_1_100M_mb_reset [get_bd_pins clock_and_reset/mb_reset] [get_bd_pins processor_ss/processor_rst]
connect_bd_net -net rst_clk_wiz_1_100M_bus_struct_reset [get_bd_pins clock_and_reset/bus_struct_reset] [get_bd_pins processor_ss/SYS_Rst]
connect_bd_net -net rst_clk_wiz_1_100M_peripheral_aresetn [get_bd_pins clock_and_reset/peripheral_aresetn] \
  [get_bd_pins memory_ss/S01_ARESETN] [get_bd_pins processor_ss/ARESETN] [get_bd_pins v_tc_0/s_axi_aresetn] \
  [get_bd_pins axi_quad_spi_0/s_axi_aresetn] [get_bd_pins axi_ethernetlite_0/s_axi_aresetn] \
  [get_bd_pins axi_timer_0/s_axi_aresetn]
connect_bd_net -net mdm_1_debug_sys_rst [get_bd_pins processor_ss/Debug_SYS_Rst] [get_bd_pins clock_and_reset/mb_debug_sys_rst]
connect_bd_net -net mig_ui_clk [get_bd_pins memory_ss/M00_ACLK] [get_bd_pins clock_and_reset/clk_in1] [get_bd_pins axi_quad_spi_0/ext_spi_clk]
connect_bd_net [get_bd_pins hls_ip_reset/gpio_io_o] [get_bd_pins v_frmbuf_rd_0/ap_rst_n] [get_bd_pins vid_out/aresetn]
connect_bd_net [get_bd_pins vid_out/locked] [get_bd_pins video_lock_monitor/gpio_io_i]
connect_bd_net [get_bd_pins vid_out/vtg_ce] [get_bd_pins v_tc_0/gen_clken]
connect_bd_net -net clk_wiz_1_clk_out2 [get_bd_pins clock_and_reset/slowest_sync_clk1] \
  [get_bd_pins processor_ss/M03_ACLK] [get_bd_pins v_tc_0/clk] [get_bd_pins vid_out/vid_io_out_clk] \
  [get_bd_pins video_lock_monitor/s_axi_aclk] [get_bd_ports clk]
connect_bd_net -net clk_wiz_1_clk_out3 [get_bd_pins clock_and_reset/slowest_sync_clk2] \
  [get_bd_pins memory_ss/S02_ACLK] [get_bd_pins processor_ss/M05_ACLK] [get_bd_pins hls_ip_reset/s_axi_aclk] \
  [get_bd_pins v_frmbuf_rd_0/ap_clk] [get_bd_pins vid_out/aclk] [get_bd_pins axi_uartlite_0/s_axi_aclk] \
  [get_bd_pins axi_quad_spi_0/s_axi_aclk] [get_bd_pins axi_ethernetlite_0/s_axi_aclk] [get_bd_pins axi_timer_0/s_axi_aclk]
connect_bd_net -net rst_clk_wiz_1_150M_peripheral_aresetn [get_bd_pins clock_and_reset/peripheral_aresetn1] \
  [get_bd_pins processor_ss/M03_ARESETN] [get_bd_pins video_lock_monitor/s_axi_aresetn]
connect_bd_net -net rst_clk_wiz_1_200M_peripheral_aresetn [get_bd_pins clock_and_reset/peripheral_aresetn2] \
  [get_bd_pins memory_ss/S02_ARESETN] [get_bd_pins processor_ss/M05_ARESETN] [get_bd_pins hls_ip_reset/s_axi_aresetn] \
  [get_bd_pins axi_uartlite_0/s_axi_aresetn]
connect_bd_net [get_bd_ports reset] [get_bd_pins memory_ss/reset] [get_bd_pins clock_and_reset/reset] [get_bd_pins clk_wiz_0/resetn]
connect_bd_net [get_bd_pins clk_wiz_0/clk_out1] [get_bd_pins memory_ss/sys_clk_i]
connect_bd_net [get_bd_pins clk_wiz_0/clk_out2] [get_bd_pins memory_ss/clk_ref_i]
connect_bd_net [get_bd_ports sys_clock] [get_bd_pins clk_wiz_0/clk_in1]
connect_bd_net [get_bd_pins vid_out/vid_hsync] [get_bd_ports vid_hsync_0]
connect_bd_net [get_bd_pins vid_out/vid_vsync] [get_bd_ports vid_vsync_0]
connect_bd_net [get_bd_pins vid_out/vid_active_video] [get_bd_ports vid_active_video_0]
connect_bd_net [get_bd_pins vid_out/vid_data] [get_bd_pins red_0/Din] [get_bd_pins green_1/Din] [get_bd_pins blue_2/Din]
connect_bd_net -net xlslice_0_Dout [get_bd_pins red_0/Dout] [get_bd_ports Red]
connect_bd_net -net xlslice_2_Dout [get_bd_pins blue_2/Dout] [get_bd_ports Blue]
connect_bd_net -net xlslice_1_Dout [get_bd_pins green_1/Dout] [get_bd_ports Green]
connect_bd_net [get_bd_pins v_frmbuf_rd_0/interrupt] [get_bd_pins xlconcat_0/In0]
connect_bd_net [get_bd_pins axi_quad_spi_0/ip2intc_irpt] [get_bd_pins xlconcat_0/In1]
connect_bd_net [get_bd_pins axi_uartlite_0/interrupt] [get_bd_pins xlconcat_0/In2]
connect_bd_net [get_bd_pins xlconcat_0/dout] [get_bd_pins processor_ss/intr]

# ---- address map ----
assign_bd_address -offset 0x00000000 -range 8K -target_address_space [get_bd_addr_spaces processor_ss/processor/Data] [get_bd_addr_segs processor_ss/processor_local_memory/dlmb_bram_if_cntlr/SLMB/Mem]
assign_bd_address -offset 0x40000000 -range 64K -target_address_space [get_bd_addr_spaces processor_ss/processor/Data] [get_bd_addr_segs video_lock_monitor/S_AXI/Reg]
assign_bd_address -offset 0x40010000 -range 64K -target_address_space [get_bd_addr_spaces processor_ss/processor/Data] [get_bd_addr_segs hls_ip_reset/S_AXI/Reg]
assign_bd_address -offset 0x40600000 -range 64K -target_address_space [get_bd_addr_spaces processor_ss/processor/Data] [get_bd_addr_segs axi_uartlite_0/S_AXI/Reg]
assign_bd_address -offset 0x40E00000 -range 64K -target_address_space [get_bd_addr_spaces processor_ss/processor/Data] [get_bd_addr_segs axi_ethernetlite_0/S_AXI/Reg]
assign_bd_address -offset 0x41200000 -range 64K -target_address_space [get_bd_addr_spaces processor_ss/processor/Data] [get_bd_addr_segs processor_ss/processor_axi_intc/S_AXI/Reg]
assign_bd_address -offset 0x41C00000 -range 64K -target_address_space [get_bd_addr_spaces processor_ss/processor/Data] [get_bd_addr_segs axi_timer_0/S_AXI/Reg]
assign_bd_address -offset 0x44A00000 -range 64K -target_address_space [get_bd_addr_spaces processor_ss/processor/Data] [get_bd_addr_segs v_tc_0/ctrl/Reg]
assign_bd_address -offset 0x44A10000 -range 64K -target_address_space [get_bd_addr_spaces processor_ss/processor/Data] [get_bd_addr_segs v_frmbuf_rd_0/s_axi_CTRL/Reg]
assign_bd_address -offset 0x44A20000 -range 64K -target_address_space [get_bd_addr_spaces processor_ss/processor/Data] [get_bd_addr_segs axi_quad_spi_0/AXI_LITE/Reg]
assign_bd_address -offset 0x80000000 -range 1G -target_address_space [get_bd_addr_spaces processor_ss/processor/Data] [get_bd_addr_segs memory_ss/mig/memmap/memaddr]
assign_bd_address -offset 0x00000000 -range 8K -target_address_space [get_bd_addr_spaces processor_ss/processor/Instruction] [get_bd_addr_segs processor_ss/processor_local_memory/ilmb_bram_if_cntlr/SLMB/Mem]
assign_bd_address -offset 0x80000000 -range 1G -target_address_space [get_bd_addr_spaces processor_ss/processor/Instruction] [get_bd_addr_segs memory_ss/mig/memmap/memaddr]
assign_bd_address -offset 0x80000000 -range 1G -target_address_space [get_bd_addr_spaces v_frmbuf_rd_0/Data_m_axi_mm_video] [get_bd_addr_segs memory_ss/mig/memmap/memaddr]

validate_bd_design
save_bd_design
